# Altium schematic sheet Project_Information.SchDoc: =project_title
size Tabloid; CompanyName: Luxonis Holding; Organization: Luxonis Holding; Address1: 1925 Harmony Park Drive; Address2: Westminster, CO; Address3: 80234; Address4: United States; SheetNumber: 1; SheetTotal: 12
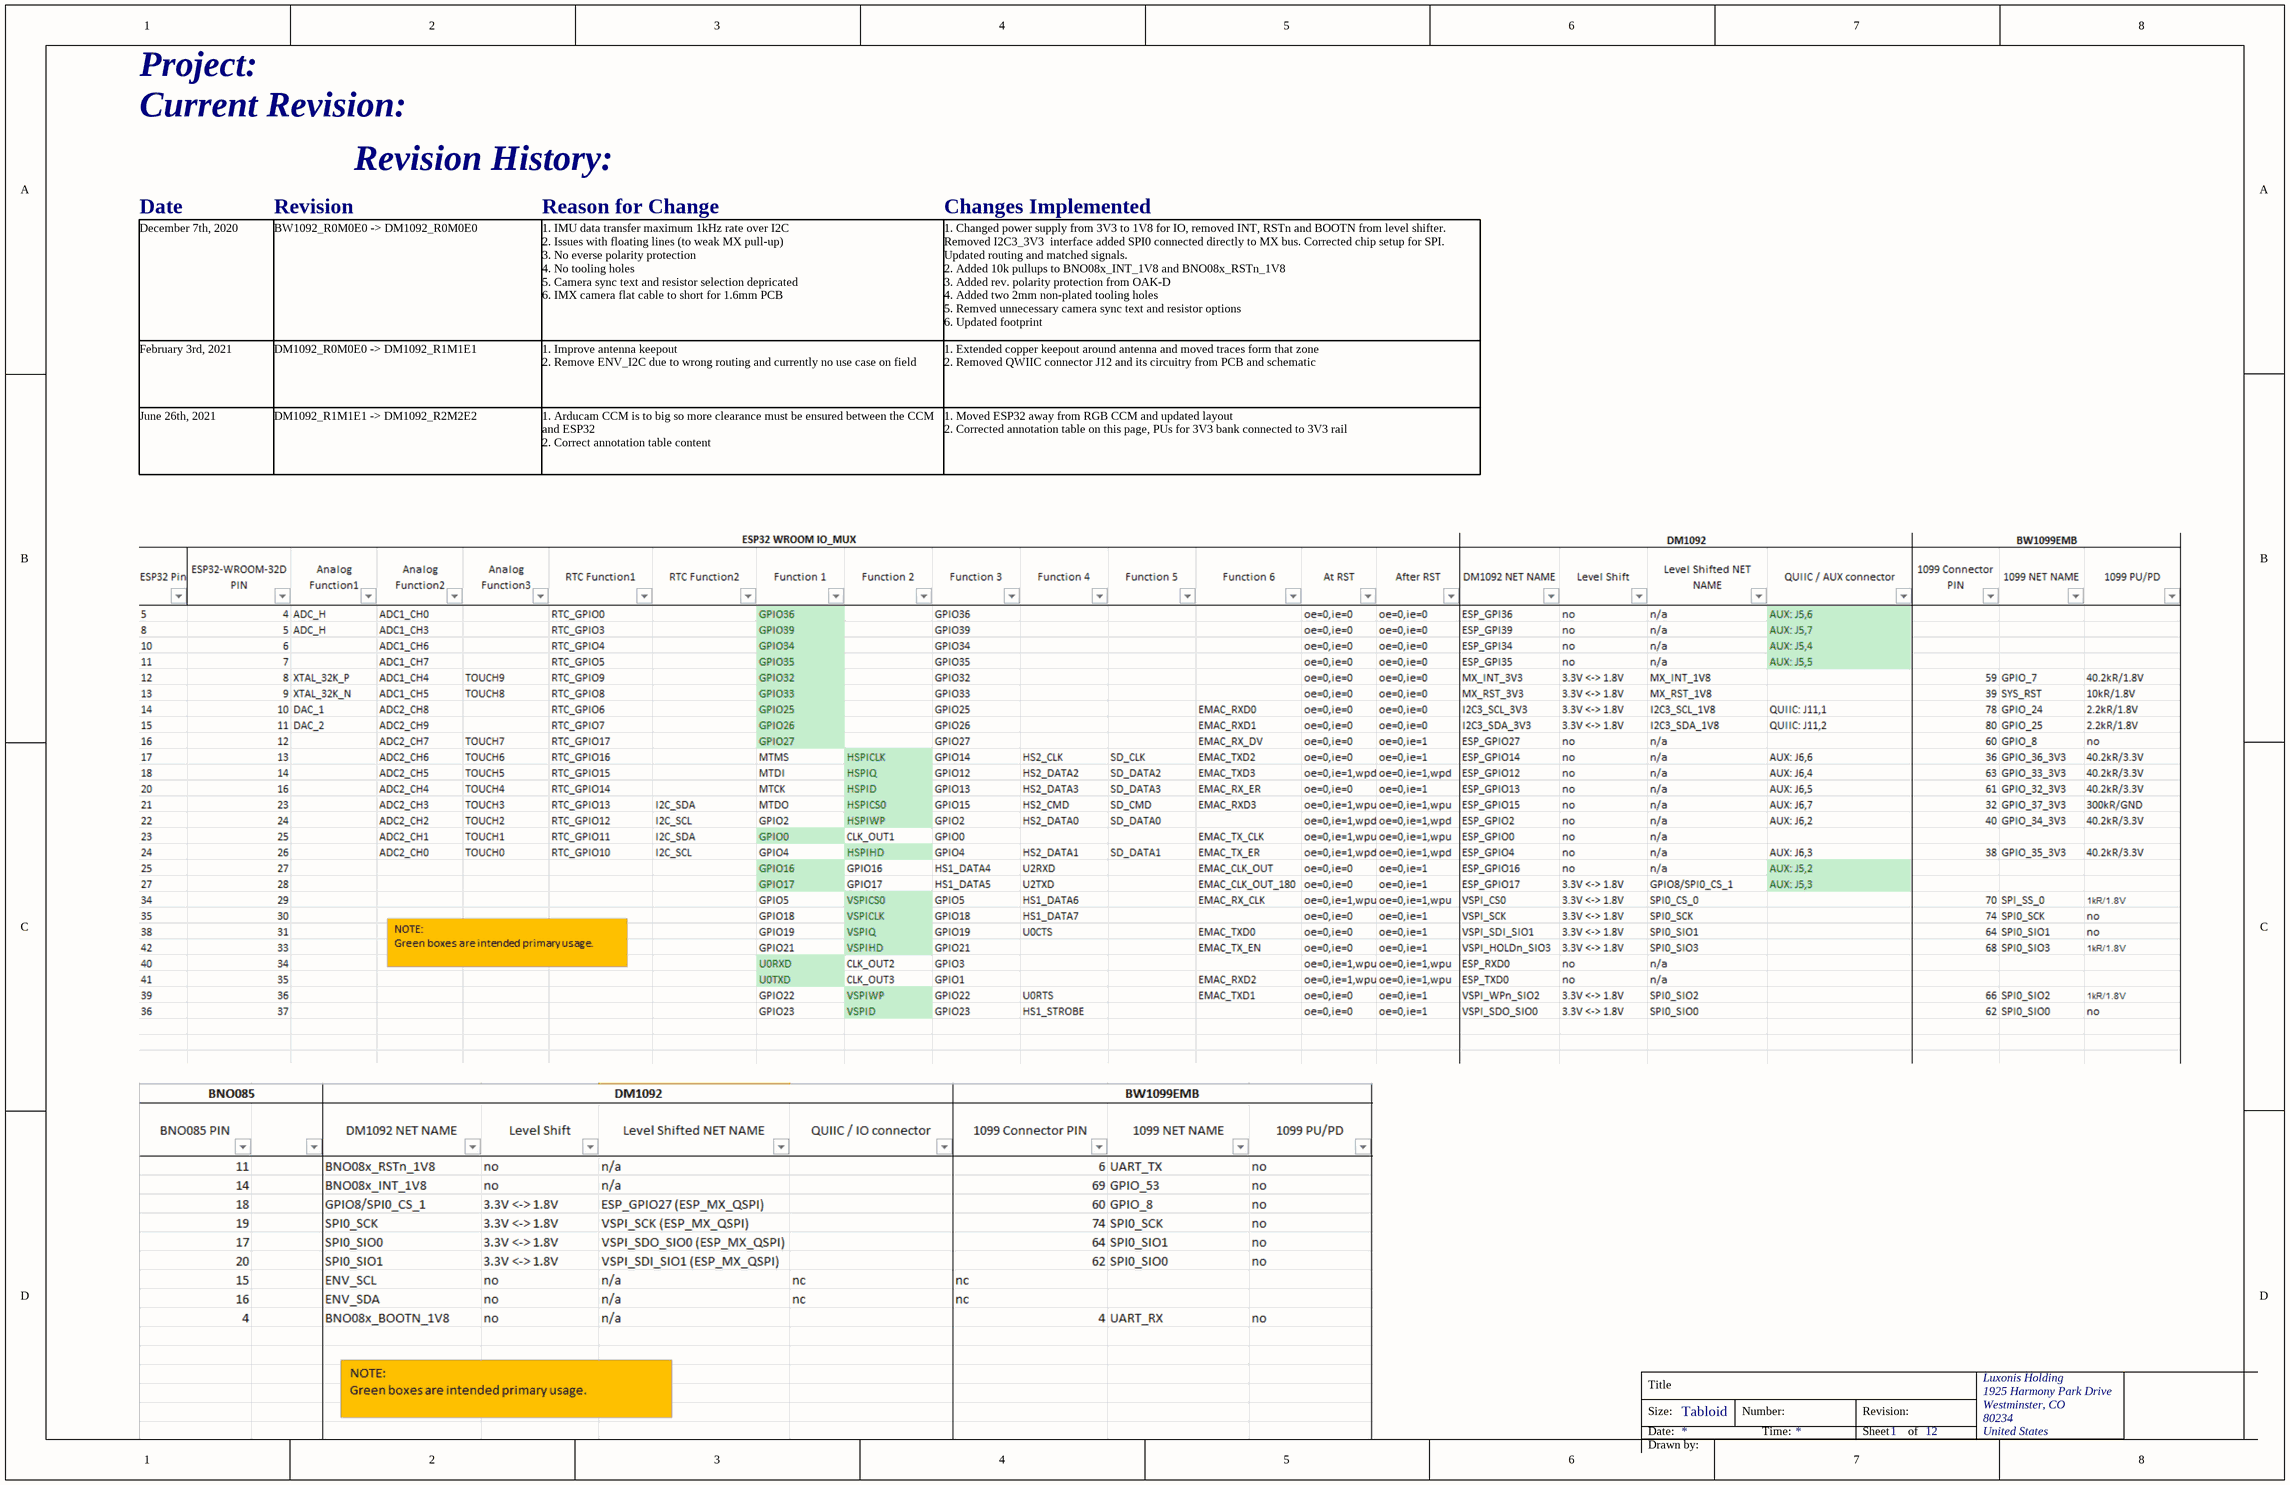
[diagram p0: Project_Information.SchDoc]

## Notes on the sheet
- Project:
- Current Revision:
- Date
- Revision
- Revision History:
- Reason for Change
- Changes Implemented
- December 7th, 2020
- BW1092_R0M0E0 -> DM1092_R0M0E0
- 1. IMU data transfer maximum 1kHz rate over I2C
  2. Issues with floating lines (to weak MX pull-up)
  3. No everse polarity protection
  4. No tooling holes
  5. Camera sync text and resistor selection depricated
  6. IMX camera flat cable to short for 1.6mm PCB
- 1. Changed power supply from 3V3 to 1V8 for IO, removed INT, RSTn and BOOTN from level shifter. Removed I2C3_3V3  interface added SPI0 connected directly to MX bus. Corrected chip setup for SPI. Updated routing and matched signals.
  2. Added 10k pullups to BNO08x_INT_1V8 and BNO08x_RSTn_1V8
  3. Added rev. polarity protection from OAK-D
  4. Added two 2mm non-plated tooling holes
  5. Remved unnecessary camera sync text and resistor options
  6. Updated footprint
- February 3rd, 2021
- DM1092_R0M0E0 -> DM1092_R1M1E1
- 1. Improve antenna keepout
  2. Remove ENV_I2C due to wrong routing and currently no use case on field
- 1. Extended copper keepout around antenna and moved traces form that zone
  2. Removed QWIIC connector J12 and its circuitry from PCB and schematic
- June 26th, 2021
- DM1092_R1M1E1 -> DM1092_R2M2E2
- 1. Arducam CCM is to big so more clearance must be ensured between the CCM and ESP32
  2. Correct annotation table content
- 1. Moved ESP32 away from RGB CCM and updated layout
  2. Corrected annotation table on this page, PUs for 3V3 bank connected to 3V3 rail
- Title
- Size:
- Date:
- Tabloid
- Number:
- Time:
- Revision:
- Sheet
- of
- Drawn by: